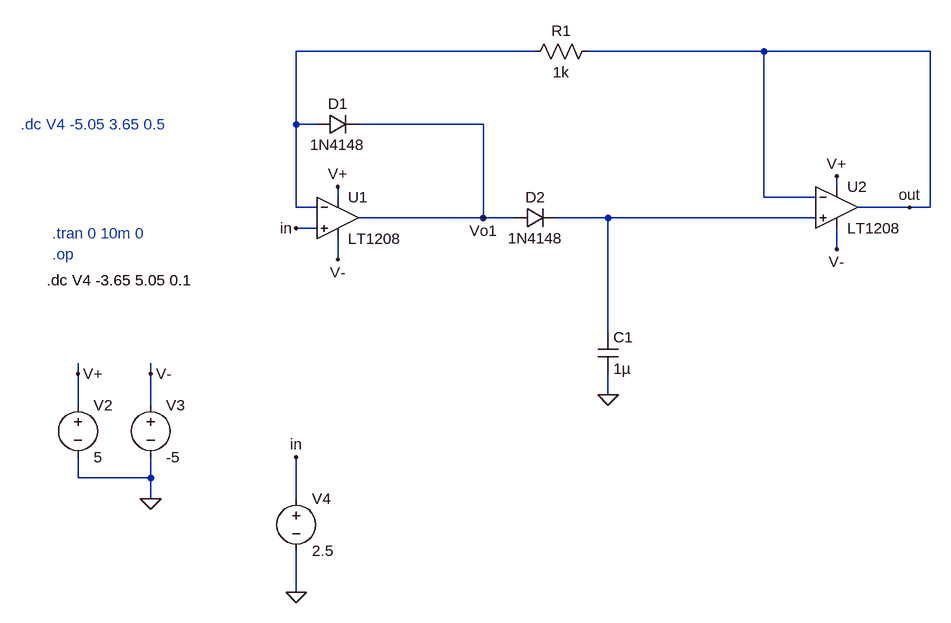
[diagram p0: schematic ETAJ 4 OP.asc]
ETAJ 4 OP.asc, the LTspice schematic file:
Version 4
SHEET 1 880 1076
WIRE -64 -192 -432 -192
WIRE 288 -192 16 -192
WIRE 544 -192 288 -192
WIRE -432 -80 -432 -192
WIRE -400 -80 -432 -80
WIRE -144 -80 -336 -80
WIRE 400 16 400 0
WIRE -368 32 -368 16
WIRE 288 32 288 -192
WIRE 368 32 288 32
WIRE -432 48 -432 -80
WIRE -400 48 -432 48
WIRE 512 48 432 48
WIRE 544 48 544 -192
WIRE 544 48 512 48
WIRE -144 64 -144 -80
WIRE -144 64 -336 64
WIRE -96 64 -144 64
WIRE 48 64 -32 64
WIRE 368 64 48 64
WIRE -400 80 -432 80
WIRE 400 112 400 80
WIRE -368 128 -368 96
WIRE 48 240 48 64
WIRE -768 304 -768 288
WIRE -656 304 -656 288
WIRE 48 336 48 304
WIRE -768 352 -768 304
WIRE -656 352 -656 304
WIRE -768 464 -768 432
WIRE -656 464 -656 432
WIRE -656 464 -768 464
WIRE -656 496 -656 464
WIRE -432 496 -432 432
WIRE -432 640 -432 576
FLAG -368 16 V+
FLAG -368 128 V-
FLAG 400 0 V+
FLAG 400 112 V-
FLAG 48 336 0
FLAG -432 80 in
FLAG 512 48 out
FLAG -432 640 0
FLAG -656 496 0
FLAG -768 304 V+
FLAG -656 304 V-
FLAG -432 432 in
FLAG -144 64 Vo1
SYMBOL diode -400 -64 R270
WINDOW 0 32 32 VTop 2
WINDOW 3 0 32 VBottom 2
SYMATTR InstName D1
SYMATTR Value 1N4148
SYMBOL diode -96 80 R270
WINDOW 0 32 32 VTop 2
WINDOW 3 0 32 VBottom 2
SYMATTR InstName D2
SYMATTR Value 1N4148
SYMBOL res 32 -208 R90
WINDOW 0 0 56 VBottom 2
WINDOW 3 32 56 VTop 2
SYMATTR InstName R1
SYMATTR Value 1k
SYMBOL cap 32 240 R0
SYMATTR InstName C1
SYMATTR Value 1µ
SYMBOL OpAmps\\LT1208 -368 0 R0
SYMATTR InstName U1
SYMBOL OpAmps\\LT1208 400 -16 R0
SYMATTR InstName U2
SYMBOL voltage -768 336 R0
WINDOW 123 0 0 Left 2
WINDOW 39 0 0 Left 2
SYMATTR InstName V2
SYMATTR Value 5
SYMBOL voltage -656 336 R0
WINDOW 123 0 0 Left 2
WINDOW 39 0 0 Left 2
SYMATTR InstName V3
SYMATTR Value -5
SYMBOL voltage -432 480 R0
WINDOW 123 0 0 Left 2
WINDOW 39 0 0 Left 2
SYMATTR InstName V4
SYMATTR Value 2.5
TEXT -808 88 Left 2 ;.tran 0 10m 0
TEXT -808 120 Left 2 ;.op
TEXT -816 160 Left 2 !.dc V4 -3.65 5.05 0.1
TEXT -856 -80 Left 2 ;.dc V4 -5.05 3.65 0.5

The netlist it stands for:
* ETAJ 4 OP.asc
D1 N001 Vo1 1N4148
D2 Vo1 N002 1N4148
R1 out N001 1k
C1 N002 0 1µ
XU1 in N001 V+ V- Vo1 LT1208  ; pins In+ In- V+ V- OUT
XU2 N002 out V+ V- out LT1208  ; pins In+ In- V+ V- OUT
V2 V+ 0 5
V3 V- 0 -5
V4 in 0 2.5
.model D D
.lib standard.dio
* .tran 0 10m 0
* .op
.dc V4 -3.65 5.05 0.1
* .dc V4 -5.05 3.65 0.5
.backanno
.end